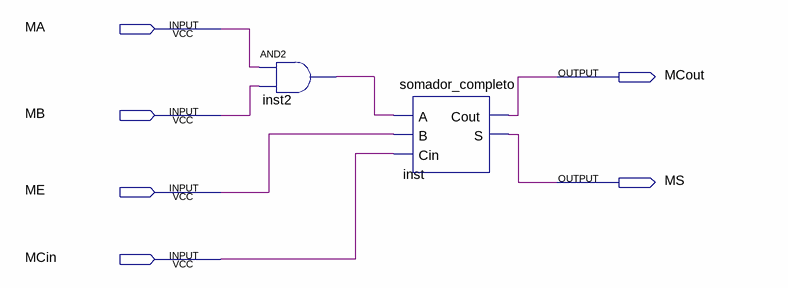
[diagram p0: schematic sheet]
// Quartus schematic mSOMADOR.bdf as structural Verilog: 2 symbols, 6 pins
module mSOMADOR (
  input  MA,
  input  MB,
  input  ME,
  input  MCin,
  output MCout,
  output MS
);

  wire inst2_out;

  and inst2 (inst2_out, MA, MB);
  somador_completo inst (.A(inst2_out), .B(ME), .Cin(MCin), .Cout(MCout), .S(MS));
endmodule
